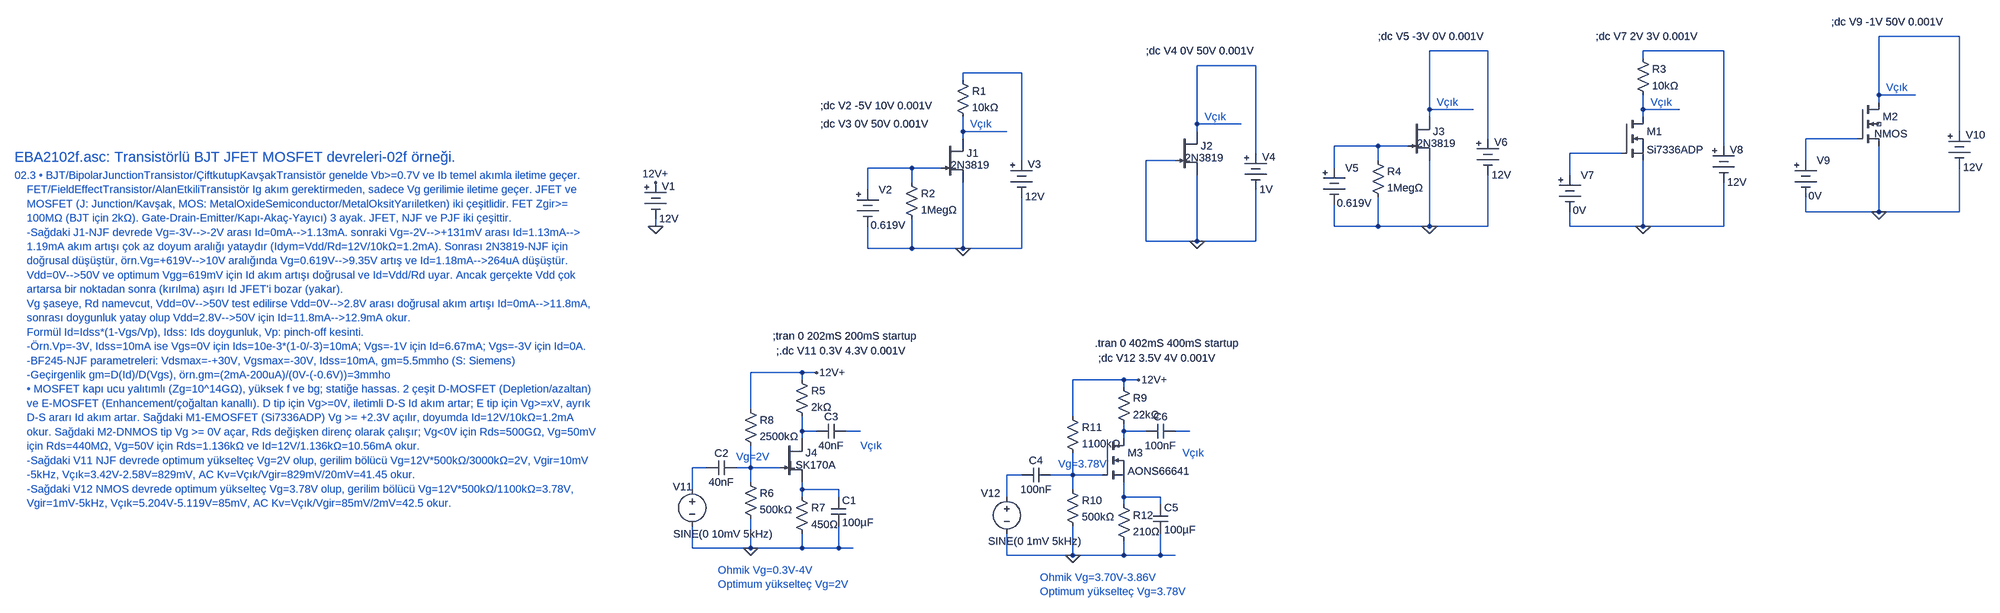
[diagram p0: schematic EBA2102f.asc]
EBA2102f.asc, the LTspice schematic file:
Version 4
SHEET 1 7064 4332
WIRE 4400 -208 4224 -208
WIRE 3264 -176 3136 -176
WIRE 3856 -176 3680 -176
WIRE 3680 -160 3680 -176
WIRE 2688 -144 2560 -144
WIRE 2176 -128 2048 -128
WIRE 2048 -112 2048 -128
WIRE 4224 -80 4224 -208
WIRE 4304 -80 4224 -80
WIRE 4224 -64 4224 -80
WIRE 3136 -48 3136 -176
WIRE 3232 -48 3136 -48
WIRE 3680 -48 3680 -80
WIRE 3760 -48 3680 -48
WIRE 3136 -32 3136 -48
WIRE 3680 -32 3680 -48
WIRE 2560 -16 2560 -144
WIRE 2656 -16 2560 -16
WIRE 2048 0 2048 -32
WIRE 2144 0 2048 0
WIRE 2560 0 2560 -16
WIRE 4400 0 4400 -208
WIRE 2048 16 2048 0
WIRE 3264 16 3264 -176
WIRE 4176 16 4064 16
WIRE 3024 32 2928 32
WIRE 3088 32 3024 32
WIRE 3856 32 3856 -176
WIRE 2688 48 2688 -144
WIRE 3632 48 3520 48
WIRE 2176 64 2176 -128
WIRE 2512 64 2448 64
WIRE 3024 64 3024 32
WIRE 4064 64 4064 16
WIRE 1936 80 1840 80
WIRE 2000 80 1936 80
WIRE 2928 80 2928 32
WIRE 3520 96 3520 48
WIRE 1936 112 1936 80
WIRE 1840 128 1840 80
WIRE 4064 176 4064 144
WIRE 4224 176 4224 32
WIRE 4224 176 4064 176
WIRE 4400 176 4400 80
WIRE 4400 176 4224 176
WIRE 1376 208 1376 192
WIRE 2928 208 2928 160
WIRE 3024 208 3024 144
WIRE 3024 208 2928 208
WIRE 3136 208 3136 64
WIRE 3136 208 3024 208
WIRE 3264 208 3264 96
WIRE 3264 208 3136 208
WIRE 3520 208 3520 176
WIRE 3680 208 3680 64
WIRE 3680 208 3520 208
WIRE 3856 208 3856 112
WIRE 3856 208 3680 208
WIRE 2448 240 2448 64
WIRE 2560 240 2560 96
WIRE 2560 240 2448 240
WIRE 2688 240 2688 128
WIRE 2688 240 2560 240
WIRE 1840 256 1840 208
WIRE 1936 256 1936 192
WIRE 1936 256 1840 256
WIRE 2048 256 2048 112
WIRE 2048 256 1936 256
WIRE 2176 256 2176 144
WIRE 2176 256 2048 256
WIRE 1696 528 1584 528
WIRE 1728 528 1696 528
WIRE 1696 544 1696 528
WIRE 2400 544 2288 544
WIRE 2432 544 2400 544
WIRE 2400 560 2400 544
WIRE 1584 608 1584 528
WIRE 2288 624 2288 544
WIRE 1696 656 1696 624
WIRE 1728 656 1696 656
WIRE 1824 656 1792 656
WIRE 2400 656 2400 640
WIRE 2448 656 2400 656
WIRE 2544 656 2512 656
WIRE 1696 672 1696 656
WIRE 2400 672 2400 656
WIRE 1488 736 1456 736
WIRE 1584 736 1584 688
WIRE 1584 736 1552 736
WIRE 1648 736 1584 736
WIRE 2176 752 2144 752
WIRE 2288 752 2288 704
WIRE 2288 752 2240 752
WIRE 2352 752 2288 752
WIRE 1584 768 1584 736
WIRE 1456 784 1456 736
WIRE 1696 784 1696 768
WIRE 1776 784 1696 784
WIRE 2288 784 2288 752
WIRE 1696 800 1696 784
WIRE 1776 800 1776 784
WIRE 2144 800 2144 752
WIRE 2400 800 2400 768
WIRE 2480 800 2400 800
WIRE 2400 816 2400 800
WIRE 2480 816 2480 800
WIRE 1456 912 1456 864
WIRE 1584 912 1584 848
WIRE 1584 912 1456 912
WIRE 1696 912 1696 880
WIRE 1696 912 1584 912
WIRE 1776 912 1776 864
WIRE 1776 912 1696 912
WIRE 1808 912 1776 912
WIRE 2144 928 2144 880
WIRE 2288 928 2288 864
WIRE 2288 928 2144 928
WIRE 2400 928 2400 896
WIRE 2400 928 2288 928
WIRE 2480 928 2480 880
WIRE 2480 928 2400 928
WIRE 2512 928 2480 928
FLAG 1376 208 0
FLAG 1376 112 12V+
FLAG 2048 256 0
FLAG 2560 240 0
FLAG 3136 208 0
FLAG 3680 208 0
FLAG 4224 176 0
FLAG 1584 912 0
FLAG 1728 528 12V+
FLAG 2288 928 0
FLAG 2432 544 12V+
SYMBOL Misc\\battery 1376 96 R0
WINDOW 3 8 95 Left 2
WINDOW 0 14 24 Left 2
SYMATTR Value 12V
SYMATTR InstName V1
SYMBOL njf 2000 16 R0
WINDOW 3 21 58 Left 2
SYMATTR Value 2N3819
SYMATTR InstName J1
SYMBOL res 2032 -128 R0
SYMATTR InstName R1
SYMATTR Value 10kΩ
SYMBOL Misc\\battery 1840 112 R0
WINDOW 3 6 93 Left 2
WINDOW 123 0 0 Left 0
WINDOW 39 0 0 Left 0
SYMATTR Value 0.619V
SYMATTR InstName V2
SYMBOL res 1920 96 R0
SYMATTR InstName R2
SYMATTR Value 1MegΩ
SYMBOL Misc\\battery 2176 48 R0
WINDOW 3 8 95 Left 2
WINDOW 0 14 24 Left 2
SYMATTR Value 12V
SYMATTR InstName V3
SYMBOL njf 2512 0 R0
WINDOW 3 21 58 Left 2
SYMATTR Value 2N3819
SYMATTR InstName J2
SYMBOL Misc\\battery 2688 32 R0
WINDOW 3 8 95 Left 2
WINDOW 0 14 24 Left 2
SYMATTR Value 1V
SYMATTR InstName V4
SYMBOL njf 3088 -32 R0
WINDOW 3 21 58 Left 2
SYMATTR Value 2N3819
SYMATTR InstName J3
SYMBOL Misc\\battery 2928 64 R0
WINDOW 3 6 93 Left 2
WINDOW 123 0 0 Left 0
WINDOW 39 0 0 Left 0
SYMATTR Value 0.619V
SYMATTR InstName V5
SYMBOL res 3008 48 R0
SYMATTR InstName R4
SYMATTR Value 1MegΩ
SYMBOL Misc\\battery 3264 0 R0
WINDOW 3 8 95 Left 2
WINDOW 0 14 24 Left 2
SYMATTR Value 12V
SYMATTR InstName V6
SYMBOL nmos 3632 -32 R0
SYMATTR InstName M1
SYMATTR Value Si7336ADP
SYMBOL Misc\\battery 3520 80 R0
WINDOW 3 6 93 Left 2
WINDOW 123 0 0 Left 0
WINDOW 39 0 0 Left 0
SYMATTR Value 0V
SYMATTR InstName V7
SYMBOL res 3664 -176 R0
SYMATTR InstName R3
SYMATTR Value 10kΩ
SYMBOL Misc\\battery 3856 16 R0
WINDOW 3 8 95 Left 2
WINDOW 0 14 24 Left 2
SYMATTR Value 12V
SYMATTR InstName V8
SYMBOL Misc\\battery 4064 48 R0
WINDOW 3 6 93 Left 2
WINDOW 123 0 0 Left 0
WINDOW 39 0 0 Left 0
SYMATTR Value 0V
SYMATTR InstName V9
SYMBOL Misc\\battery 4400 -16 R0
WINDOW 3 8 95 Left 2
WINDOW 0 14 24 Left 2
SYMATTR Value 12V
SYMATTR InstName V10
SYMBOL nmos4 4176 -64 R0
WINDOW 3 38 69 Left 2
SYMATTR InstName M2
SYMBOL njf 1648 672 R0
WINDOW 3 21 58 Left 2
SYMATTR Value LSK170A
SYMATTR InstName J4
SYMBOL res 1680 528 R0
SYMATTR InstName R5
SYMATTR Value 2kΩ
SYMBOL res 1568 752 R0
SYMATTR InstName R6
SYMATTR Value 500kΩ
SYMBOL res 1680 784 R0
SYMATTR InstName R7
SYMATTR Value 450Ω
SYMBOL cap 1760 800 R0
SYMATTR InstName C1
SYMATTR Value 100µF
SYMBOL res 1568 592 R0
SYMATTR InstName R8
SYMATTR Value 2500kΩ
SYMBOL voltage 1456 768 R0
WINDOW 0 -42 10 Left 2
WINDOW 3 -41 113 Left 2
WINDOW 123 0 0 Left 0
WINDOW 39 0 0 Left 0
SYMATTR InstName V11
SYMATTR Value SINE(0 10mV 5kHz)
SYMBOL cap 1552 720 R90
WINDOW 0 0 32 VBottom 2
WINDOW 3 32 32 VTop 2
SYMATTR InstName C2
SYMATTR Value 40nF
SYMBOL cap 1792 640 R90
WINDOW 0 0 32 VBottom 2
WINDOW 3 32 32 VTop 2
SYMATTR InstName C3
SYMATTR Value 40nF
SYMBOL res 2384 544 R0
SYMATTR InstName R9
SYMATTR Value 22kΩ
SYMBOL res 2272 768 R0
SYMATTR InstName R10
SYMATTR Value 500kΩ
SYMBOL nmos 2352 672 R0
SYMATTR InstName M3
SYMATTR Value AONS66641
SYMBOL res 2272 608 R0
SYMATTR InstName R11
SYMATTR Value 1100kΩ
SYMBOL voltage 2144 784 R0
WINDOW 0 -57 8 Left 2
WINDOW 3 -41 113 Left 2
WINDOW 123 0 0 Left 0
WINDOW 39 0 0 Left 0
SYMATTR InstName V12
SYMATTR Value SINE(0 1mV 5kHz)
SYMBOL cap 2240 736 R90
WINDOW 0 0 32 VBottom 2
WINDOW 3 32 32 VTop 2
SYMATTR InstName C4
SYMATTR Value 100nF
SYMBOL res 2384 800 R0
SYMATTR InstName R12
SYMATTR Value 210Ω
SYMBOL cap 2464 816 R0
SYMATTR InstName C5
SYMATTR Value 100µF
SYMBOL cap 2512 640 R90
WINDOW 0 0 32 VBottom 2
WINDOW 3 32 32 VTop 2
SYMATTR InstName C6
SYMATTR Value 100nF
TEXT -232 56 Left 3 ;EBA2102f.asc: Transistörlü BJT JFET MOSFET devreleri-02f örneği.
TEXT -232 96 Left 2 ;02.3 • BJT/BipolarJunctionTransistor/ÇiftkutupKavşakTransistör genelde Vb>=0.7V ve Ib temel akımla iletime geçer.\n    FET/FieldEffectTransistor/AlanEtkiliTransistör Ig akım gerektirmeden, sadece Vg gerilimie iletime geçer. JFET ve\n    MOSFET (J: Junction/Kavşak, MOS: MetalOxideSemiconductor/MetalOksitYarıiletken) iki çeşitlidir. FET Zgir>=\n    100MΩ (BJT için 2kΩ). Gate-Drain-Emitter/Kapı-Akaç-Yayıcı) 3 ayak. JFET, NJF ve PJF iki çeşittir.\n    -Sağdaki J1-NJF devrede Vg=-3V-->-2V arası Id=0mA-->1.13mA. sonraki Vg=-2V-->+131mV arası Id=1.13mA-->\n    1.19mA akım artışı çok az doyum aralığı yataydır (Idym=Vdd/Rd=12V/10kΩ=1.2mA). Sonrası 2N3819-NJF için\n    doğrusal düşüştür, örn.Vg=+619V-->10V aralığında Vg=0.619V-->9.35V artış ve Id=1.18mA-->264uA düşüştür.\n    Vdd=0V-->50V ve optimum Vgg=619mV için Id akım artışı doğrusal ve Id=Vdd/Rd uyar. Ancak gerçekte Vdd çok\n    artarsa bir noktadan sonra (kırılma) aşırı Id JFET'i bozar (yakar).\n    Vg şaseye, Rd namevcut, Vdd=0V-->50V test edilirse Vdd=0V-->2.8V arası doğrusal akım artışı Id=0mA-->11.8mA,\n    sonrası doygunluk yatay olup Vdd=2.8V-->50V için Id=11.8mA-->12.9mA okur.\n    Formül Id=Idss*(1-Vgs/Vp), Idss: Ids doygunluk, Vp: pinch-off kesinti.\n    -Örn.Vp=-3V, Idss=10mA ise Vgs=0V için Ids=10e-3*(1-0/-3)=10mA; Vgs=-1V için Id=6.67mA; Vgs=-3V için Id=0A.\n    -BF245-NJF parametreleri: Vdsmax=-+30V, Vgsmax=-30V, Idss=10mA, gm=5.5mmho (S: Siemens)\n    -Geçirgenlik gm=D(Id)/D(Vgs), örn.gm=(2mA-200uA)/(0V-(-0.6V))=3mmho\n    • MOSFET kapı ucu yalıtımlı (Zg=10^14GΩ), yüksek f ve bg; statiğe hassas. 2 çeşit D-MOSFET (Depletion/azaltan)\n    ve E-MOSFET (Enhancement/çoğaltan kanallı). D tip için Vg>=0V, iletimli D-S Id akım artar; E tip için Vg>=xV, ayrık \n    D-S ararı Id akım artar. Sağdaki M1-EMOSFET (Si7336ADP) Vg >= +2.3V açılır, doyumda Id=12V/10kΩ=1.2mA \n    okur. Sağdaki M2-DNMOS tip Vg >= 0V açar, Rds değişken direnç olarak çalışır; Vg<0V için Rds=500GΩ, Vg=50mV\n    için Rds=440MΩ, Vg=50V için Rds=1.136kΩ ve Id=12V/1.136kΩ=10.56mA okur.\n    -Sağdaki V11 NJF devrede optimum yükselteç Vg=2V olup, gerilim bölücü Vg=12V*500kΩ/3000kΩ=2V, Vgir=10mV\n    -5kHz, Vçık=3.42V-2.58V=829mV, AC Kv=Vçık/Vgir=829mV/20mV=41.45 okur.\n    -Sağdaki V12 NMOS devrede optimum yükselteç Vg=3.78V olup, gerilim bölücü Vg=12V*500kΩ/1100kΩ=3.78V, \n    Vgir=1mV-5kHz, Vçık=5.204V-5.119V=85mV, AC Kv=Vçık/Vgir=85mV/2mV=42.5 okur.
TEXT 2064 -16 Left 2 ;Vçık
TEXT 1736 -56 Left 2 !;dc V2 -5V 10V 0.001V
TEXT 1736 -16 Left 2 !;dc V3 0V 50V 0.001V
TEXT 2576 -32 Left 2 ;Vçık
TEXT 2448 -176 Left 2 !;dc V4 0V 50V 0.001V
TEXT 3152 -64 Left 2 ;Vçık
TEXT 3024 -208 Left 2 !;dc V5 -3V 0V 0.001V
TEXT 3576 -208 Left 2 !;dc V7 2V 3V 0.001V
TEXT 3696 -64 Left 2 ;Vçık
TEXT 4120 -240 Left 2 !;dc V9 -1V 50V 0.001V
TEXT 4240 -96 Left 2 ;Vçık
TEXT 1824 688 Left 2 ;Vçık
TEXT 1640 480 Left 2 !;.dc V11 0.3V 4.3V 0.001V
TEXT 1512 960 Left 2 ;Ohmik Vg=0.3V-4V\nOptimum yükselteç Vg=2V
TEXT 1632 448 Left 2 !;tran 0 202mS 200mS startup
TEXT 1552 712 Left 2 ;Vg=2V
TEXT 2528 704 Left 2 ;Vçık
TEXT 2344 496 Left 2 !;dc V12 3.5V 4V 0.001V
TEXT 2216 976 Left 2 ;Ohmik Vg=3.70V-3.86V\nOptimum yükselteç Vg=3.78V
TEXT 2336 464 Left 2 !.tran 0 402mS 400mS startup
TEXT 2256 728 Left 2 ;Vg=3.78V

The netlist it stands for:
* EBA2102f.asc
V1 12V+ 0 12V
J1 N007 N011 0 2N3819
R1 N005 N007 10kΩ
V2 N011 0 0.619V
R2 N011 0 1MegΩ
V3 N005 0 12V
J2 N004 0 0 2N3819
V4 N004 0 1V
J3 N002 N009 0 2N3819
V5 N009 0 0.619V
R4 N009 0 1MegΩ
V6 N002 0 12V
M1 N006 N010 0 0 Si7336ADP
V7 N010 0 0V
R3 N003 N006 10kΩ
V8 N003 0 12V
V9 N008 0 0V
V10 N001 0 12V
M2 N001 N008 0 NC_01 NMOS
J4 N012 N017 N020 LSK170A
R5 12V+ N012 2kΩ
R6 N017 0 500kΩ
R7 N020 0 450Ω
C1 N020 0 100µF
R8 12V+ N017 2500kΩ
V11 N016 0 SINE(0 10mV 5kHz)
C2 N017 N016 40nF
C3 N013 N012 40nF
R9 12V+ N014 22kΩ
R10 N019 0 500kΩ
M3 N014 N019 N021 N021 AONS66641
R11 12V+ N019 1100kΩ
V12 N018 0 SINE(0 1mV 5kHz)
C4 N019 N018 100nF
R12 N021 0 210Ω
C5 N021 0 100µF
C6 N015 N014 100nF
.model NJF NJF
.model PJF PJF
.lib standard.jft
.model NMOS NMOS
.model PMOS PMOS
.lib standard.mos
* EBA2102f.asc: Transistörlü BJT JFET MOSFET devreleri-02f örneği.
* 02.3 • BJT/BipolarJunctionTransistor/ÇiftkutupKavşakTransistör genelde Vb>=0.7V ve Ib temel akımla iletime geçer.
*     FET/FieldEffectTransistor/AlanEtkiliTransistör Ig akım gerektirmeden, sadece Vg gerilimie iletime geçer. JFET ve
*     MOSFET (J: Junction/Kavşak, MOS: MetalOxideSemiconductor/MetalOksitYarıiletken) iki çeşitlidir. FET Zgir>=
*     100MΩ (BJT için 2kΩ). Gate-Drain-Emitter/Kapı-Akaç-Yayıcı) 3 ayak. JFET, NJF ve PJF iki çeşittir.
*     -Sağdaki J1-NJF devrede Vg=-3V-->-2V arası Id=0mA-->1.13mA. sonraki Vg=-2V-->+131mV arası Id=1.13mA-->
*     1.19mA akım artışı çok az doyum aralığı yataydır (Idym=Vdd/Rd=12V/10kΩ=1.2mA). Sonrası 2N3819-NJF için
*     doğrusal düşüştür, örn.Vg=+619V-->10V aralığında Vg=0.619V-->9.35V artış ve Id=1.18mA-->264uA düşüştür.
*     Vdd=0V-->50V ve optimum Vgg=619mV için Id akım artışı doğrusal ve Id=Vdd/Rd uyar. Ancak gerçekte Vdd çok
*     artarsa bir noktadan sonra (kırılma) aşırı Id JFET'i bozar (yakar).
*     Vg şaseye, Rd namevcut, Vdd=0V-->50V test edilirse Vdd=0V-->2.8V arası doğrusal akım artışı Id=0mA-->11.8mA,
*     sonrası doygunluk yatay olup Vdd=2.8V-->50V için Id=11.8mA-->12.9mA okur.
*     Formül Id=Idss*(1-Vgs/Vp), Idss: Ids doygunluk, Vp: pinch-off kesinti.
*     -Örn.Vp=-3V, Idss=10mA ise Vgs=0V için Ids=10e-3*(1-0/-3)=10mA; Vgs=-1V için Id=6.67mA; Vgs=-3V için Id=0A.
*     -BF245-NJF parametreleri: Vdsmax=-+30V, Vgsmax=-30V, Idss=10mA, gm=5.5mmho (S: Siemens)
*     -Geçirgenlik gm=D(Id)/D(Vgs), örn.gm=(2mA-200uA)/(0V-(-0.6V))=3mmho
*     • MOSFET kapı ucu yalıtımlı (Zg=10^14GΩ), yüksek f ve bg; statiğe hassas. 2 çeşit D-MOSFET (Depletion/azaltan)
*     ve E-MOSFET (Enhancement/çoğaltan kanallı). D tip için Vg>=0V, iletimli D-S Id akım artar; E tip için Vg>=xV, ayrık
*     D-S ararı Id akım artar. Sağdaki M1-EMOSFET (Si7336ADP) Vg >= +2.3V açılır, doyumda Id=12V/10kΩ=1.2mA
*     okur. Sağdaki M2-DNMOS tip Vg >= 0V açar, Rds değişken direnç olarak çalışır; Vg<0V için Rds=500GΩ, Vg=50mV
*     için Rds=440MΩ, Vg=50V için Rds=1.136kΩ ve Id=12V/1.136kΩ=10.56mA okur.
*     -Sağdaki V11 NJF devrede optimum yükselteç Vg=2V olup, gerilim bölücü Vg=12V*500kΩ/3000kΩ=2V, Vgir=10mV
*     -5kHz, Vçık=3.42V-2.58V=829mV, AC Kv=Vçık/Vgir=829mV/20mV=41.45 okur.
*     -Sağdaki V12 NMOS devrede optimum yükselteç Vg=3.78V olup, gerilim bölücü Vg=12V*500kΩ/1100kΩ=3.78V,
*     Vgir=1mV-5kHz, Vçık=5.204V-5.119V=85mV, AC Kv=Vçık/Vgir=85mV/2mV=42.5 okur.
* Vçık
;dc V2 -5V 10V 0.001V
;dc V3 0V 50V 0.001V
* Vçık
;dc V4 0V 50V 0.001V
* Vçık
;dc V5 -3V 0V 0.001V
;dc V7 2V 3V 0.001V
* Vçık
;dc V9 -1V 50V 0.001V
* Vçık
* Vçık
;.dc V11 0.3V 4.3V 0.001V
* Ohmik Vg=0.3V-4V
* Optimum yükselteç Vg=2V
;tran 0 202mS 200mS startup
* Vg=2V
* Vçık
;dc V12 3.5V 4V 0.001V
* Ohmik Vg=3.70V-3.86V
* Optimum yükselteç Vg=3.78V
.tran 0 402mS 400mS startup
* Vg=3.78V
.backanno
.end